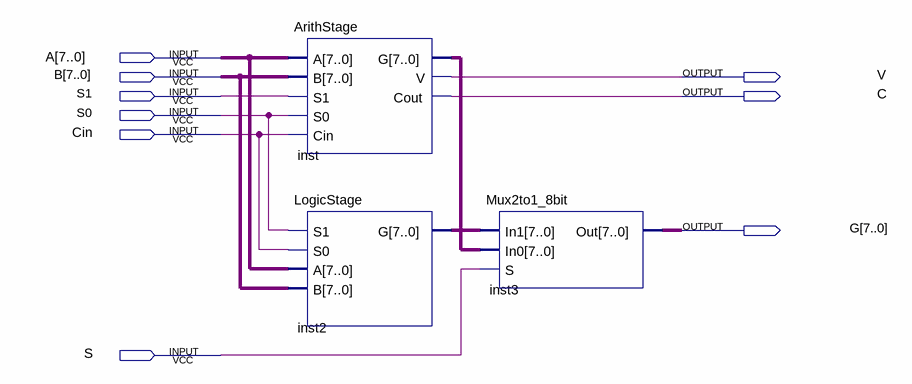
[diagram p0: schematic sheet]
// Quartus schematic ALUStage.bdf as structural Verilog: 3 symbols, 9 pins
module ALUStage (
  input  [7:0] A,
  input  [7:0] B,
  input  S1,
  input  S0,
  input  Cin,
  input  S,
  output V,
  output C,
  output [7:0] G
);

  wire [7:0] inst2_g, inst_g;

  ArithStage inst (.A(A), .B(B), .S1(S1), .S0(S0), .Cin(Cin), .G(inst_g), .V(V), .Cout(C));
  LogicStage inst2 (.S1(S0), .S0(Cin), .A(A), .B(B), .G(inst2_g));
  Mux2to1_8bit inst3 (.In1(inst2_g), .In0(inst_g), .S(S), .Out(G));
endmodule
